# Altium schematic sheet myirBoard.SchDoc
size A4
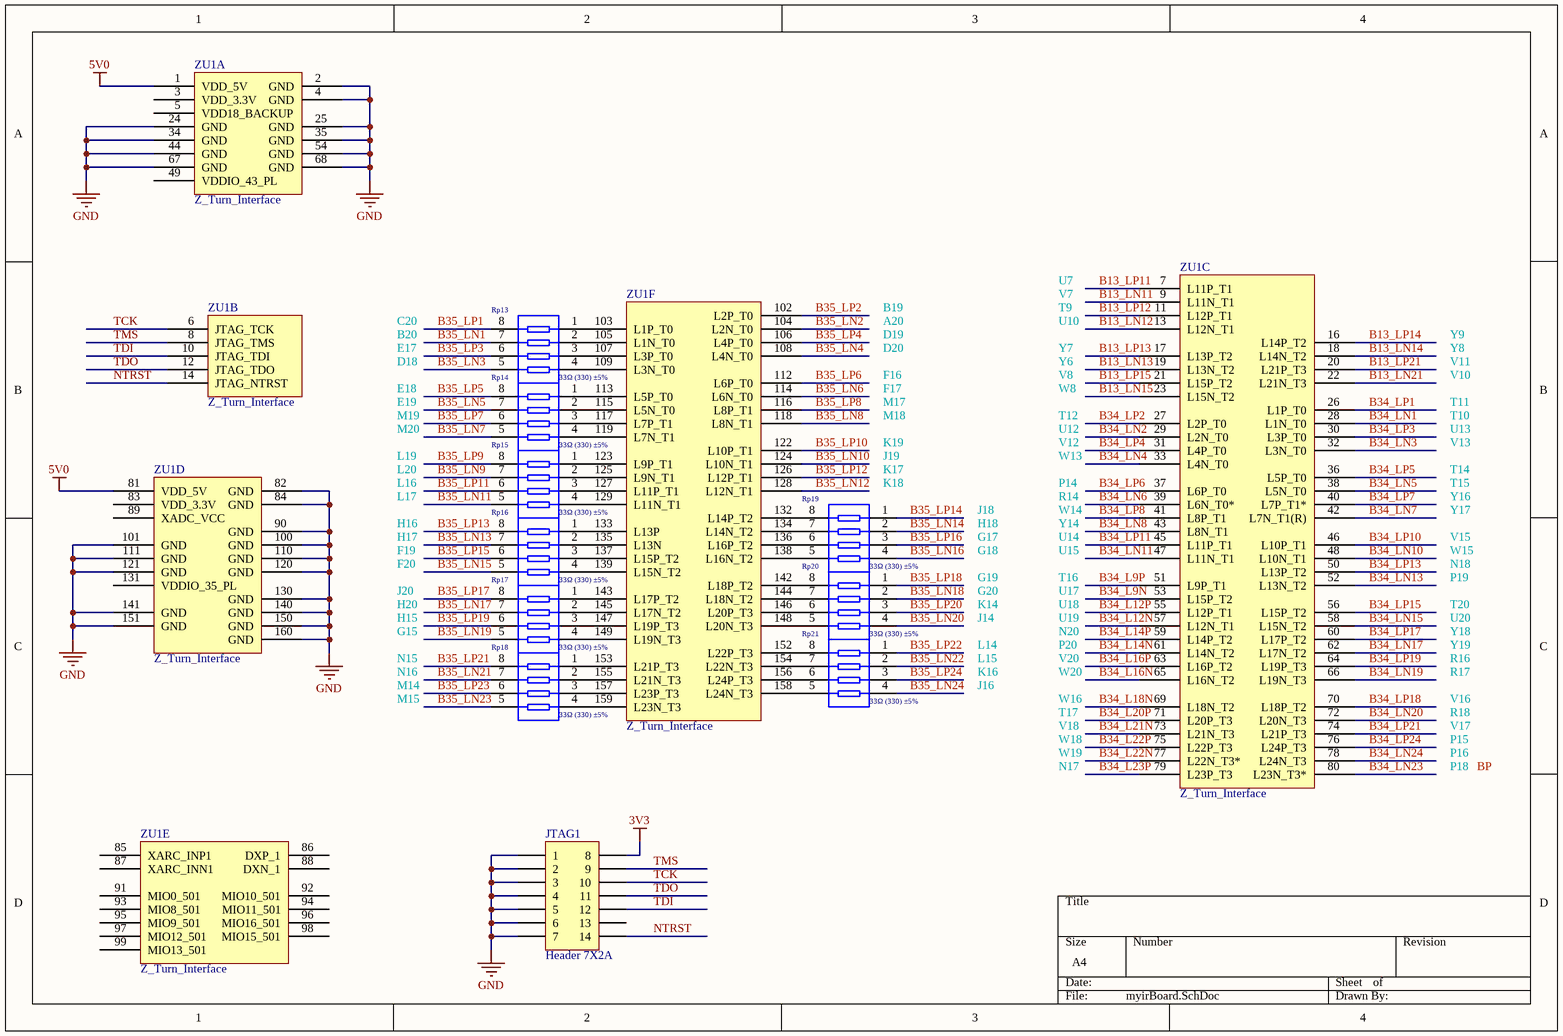
[diagram p0: myirBoard.SchDoc]

## Parts
JTAG1  Header 7X2A  [HDR2X7_CEN]
Rp13  33Ω (330) ±5%  [0402_Rx4]
Rp14  33Ω (330) ±5%  [0402_Rx4]
Rp15  33Ω (330) ±5%  [0402_Rx4]
Rp16  33Ω (330) ±5%  [0402_Rx4]
Rp17  33Ω (330) ±5%  [0402_Rx4]
Rp18  33Ω (330) ±5%  [0402_Rx4]
Rp19  33Ω (330) ±5%  [0402_Rx4]
Rp20  33Ω (330) ±5%  [0402_Rx4]
Rp21  33Ω (330) ±5%  [0402_Rx4]
ZU1  Z_Turn_Interface  [ZTURN]  (parts A,B,C,D,E,F of 6)

## Nets
3V3: JTAG1.8
5V0: ZU1.1(VDD_5V) ZU1.81(VDD_5V)
GND: JTAG1.1 JTAG1.2 JTAG1.3 JTAG1.4 JTAG1.5 JTAG1.6 JTAG1.7 ZU1.2(GND) ZU1.4(GND) ZU1.24(GND) ZU1.25(GND) ZU1.34(GND) ZU1.35(GND) ZU1.44(GND) ZU1.54(GND) ZU1.67(GND) ZU1.68(GND) ZU1.82(GND) ZU1.84(GND) ZU1.90(GND) ZU1.100(GND) ZU1.101(GND) ZU1.110(GND) ZU1.111(GND) ZU1.120(GND) ZU1.121(GND) ZU1.130(GND) ZU1.140(GND) ZU1.141(GND) ZU1.150(GND) ZU1.151(GND) ZU1.160(GND)
B13_LN11: ZU1.9(L11N_T1)
B13_LN12: ZU1.13(L12N_T1)
B13_LN13: ZU1.19(L13N_T2)
B13_LN14: ZU1.18(L14N_T2)
B13_LN15: ZU1.23(L15N_T2)
B13_LN21: ZU1.22(L21N_T3)
B13_LP11: ZU1.7(L11P_T1)
B13_LP12: ZU1.11(L12P_T1)
B13_LP13: ZU1.17(L13P_T2)
B13_LP14: ZU1.16(L14P_T2)
B13_LP15: ZU1.21(L15P_T2)
B13_LP21: ZU1.20(L21P_T3)
B34_L9N: ZU1.53(L15P_T2)
B34_L9P: ZU1.51(L9P_T1)
B34_L12N: ZU1.57(L12N_T1)
B34_L12P: ZU1.55(L12P_T1)
B34_L14N: ZU1.61(L14N_T2)
B34_L14P: ZU1.59(L14P_T2)
B34_L16N: ZU1.65(L16N_T2)
B34_L16P: ZU1.63(L16P_T2)
B34_L18N: ZU1.69(L18N_T2)
B34_L20P: ZU1.71(L20P_T3)
B34_L21N: ZU1.73(L21N_T3)
B34_L22N: ZU1.77(L22N_T3*)
B34_L22P: ZU1.75(L22P_T3)
B34_L23P: ZU1.79(L23P_T3)
B34_LN1: ZU1.28(L1N_T0)
B34_LN2: ZU1.29(L2N_T0)
B34_LN3: ZU1.32(L3N_T0)
B34_LN4: ZU1.33(L4N_T0)
B34_LN5: ZU1.38(L5N_T0)
B34_LN6: ZU1.39(L6N_T0*)
B34_LN7: ZU1.42(L7N_T1(R))
B34_LN8: ZU1.43(L8N_T1)
B34_LN10: ZU1.48(L10N_T1)
B34_LN11: ZU1.47(L11N_T1)
B34_LN13: ZU1.52(L13N_T2)
B34_LN15: ZU1.58(L15N_T2)
B34_LN17: ZU1.62(L17N_T2)
B34_LN19: ZU1.66(L19N_T3)
B34_LN20: ZU1.72(L20N_T3)
B34_LN23: ZU1.80(L23N_T3*)
B34_LN24: ZU1.78(L24N_T3)
B34_LP1: ZU1.26(L1P_T0)
B34_LP2: ZU1.27(L2P_T0)
B34_LP3: ZU1.30(L3P_T0)
B34_LP4: ZU1.31(L4P_T0)
B34_LP5: ZU1.36(L5P_T0)
B34_LP6: ZU1.37(L6P_T0)
B34_LP7: ZU1.40(L7P_T1*)
B34_LP8: ZU1.41(L8P_T1)
B34_LP10: ZU1.46(L10P_T1)
B34_LP11: ZU1.45(L11P_T1)
B34_LP13: ZU1.50(L13P_T2)
B34_LP15: ZU1.56(L15P_T2)
B34_LP17: ZU1.60(L17P_T2)
B34_LP18: ZU1.70(L18P_T2)
B34_LP19: ZU1.64(L19P_T3)
B34_LP21: ZU1.74(L21P_T3)
B34_LP24: ZU1.76(L24P_T3)
B35_LN1: Rp13.7
B35_LN2: ZU1.104(L2N_T0)
B35_LN3: Rp13.5
B35_LN4: ZU1.108(L4N_T0)
B35_LN5: Rp14.7
B35_LN6: ZU1.114(L6N_T0)
B35_LN7: Rp14.5
B35_LN8: ZU1.118(L8N_T1)
B35_LN9: Rp15.7
B35_LN10: ZU1.124(L10N_T1)
B35_LN11: Rp15.5
B35_LN12: ZU1.128(L12N_T1)
B35_LN13: Rp16.7
B35_LN14: Rp19.2
B35_LN15: Rp16.5
B35_LN16: Rp19.4
B35_LN17: Rp17.7
B35_LN18: Rp20.2
B35_LN19: Rp17.5
B35_LN20: Rp20.4
B35_LN21: Rp18.7
B35_LN22: Rp21.2
B35_LN23: Rp18.5
B35_LN24: Rp21.4
B35_LP1: Rp13.8
B35_LP2: ZU1.102(L2P_T0)
B35_LP3: Rp13.6
B35_LP4: ZU1.106(L4P_T0)
B35_LP5: Rp14.8
B35_LP6: ZU1.112(L6P_T0)
B35_LP7: Rp14.6
B35_LP8: ZU1.116(L8P_T1)
B35_LP9: Rp15.8
B35_LP10: ZU1.122(L10P_T1)
B35_LP11: Rp15.6
B35_LP12: ZU1.126(L12P_T1)
B35_LP13: Rp16.8
B35_LP14: Rp19.1
B35_LP15: Rp16.6
B35_LP16: Rp19.3
B35_LP17: Rp17.8
B35_LP18: Rp20.1
B35_LP19: Rp17.6
B35_LP20: Rp20.3
B35_LP21: Rp18.8
B35_LP22: Rp21.1
B35_LP23: Rp18.6
B35_LP24: Rp21.3
NTRST: JTAG1.14 ZU1.14(JTAG_NTRST)
TCK: JTAG1.10 ZU1.6(JTAG_TCK)
TDI: JTAG1.12 ZU1.10(JTAG_TDI)
TDO: JTAG1.11 ZU1.12(JTAG_TDO)
TMS: JTAG1.9 ZU1.8(JTAG_TMS)
NetRp13_1: Rp13.1 ZU1.103(L1P_T0)
NetRp13_2: Rp13.2 ZU1.105(L1N_T0)
NetRp13_3: Rp13.3 ZU1.107(L3P_T0)
NetRp13_4: Rp13.4 ZU1.109(L3N_T0)
NetRp14_1: Rp14.1 ZU1.113(L5P_T0)
NetRp14_2: Rp14.2 ZU1.115(L5N_T0)
NetRp14_3: Rp14.3 ZU1.117(L7P_T1)
NetRp14_4: Rp14.4 ZU1.119(L7N_T1)
NetRp15_1: Rp15.1 ZU1.123(L9P_T1)
NetRp15_2: Rp15.2 ZU1.125(L9N_T1)
NetRp15_3: Rp15.3 ZU1.127(L11P_T1)
NetRp15_4: Rp15.4 ZU1.129(L11N_T1)
NetRp16_1: Rp16.1 ZU1.133(L13P)
NetRp16_2: Rp16.2 ZU1.135(L13N)
NetRp16_3: Rp16.3 ZU1.137(L15P_T2)
NetRp16_4: Rp16.4 ZU1.139(L15N_T2)
NetRp17_1: Rp17.1 ZU1.143(L17P_T2)
NetRp17_2: Rp17.2 ZU1.145(L17N_T2)
NetRp17_3: Rp17.3 ZU1.147(L19P_T3)
NetRp17_4: Rp17.4 ZU1.149(L19N_T3)
NetRp18_1: Rp18.1 ZU1.153(L21P_T3)
NetRp18_2: Rp18.2 ZU1.155(L21N_T3)
NetRp18_3: Rp18.3 ZU1.157(L23P_T3)
NetRp18_4: Rp18.4 ZU1.159(L23N_T3)
NetRp19_5: Rp19.5 ZU1.138(L16N_T2)
NetRp19_6: Rp19.6 ZU1.136(L16P_T2)
NetRp19_7: Rp19.7 ZU1.134(L14N_T2)
NetRp19_8: Rp19.8 ZU1.132(L14P_T2)
NetRp20_5: Rp20.5 ZU1.148(L20N_T3)
NetRp20_6: Rp20.6 ZU1.146(L20P_T3)
NetRp20_7: Rp20.7 ZU1.144(L18N_T2)
NetRp20_8: Rp20.8 ZU1.142(L18P_T2)
NetRp21_5: Rp21.5 ZU1.158(L24N_T3)
NetRp21_6: Rp21.6 ZU1.156(L24P_T3)
NetRp21_7: Rp21.7 ZU1.154(L22N_T3)
NetRp21_8: Rp21.8 ZU1.152(L22P_T3)

Not connected (* = marked no-connect by the designer): JTAG1 13; ZU1 3(VDD_3.3V) 5(VDD18_BACKUP) 49(VDDIO_43_PL) 83(VDD_3.3V) 85(XARC_INP1) 86(DXP_1) 87(XARC_INN1) 88(DXN_1) 89(XADC_VCC) 91(MIO0_501) 92(MIO10_501) 93(MIO8_501) 94(MIO11_501) 95(MIO9_501) 96(MIO16_501) 97(MIO12_501) 98(MIO15_501) 99(MIO13_501) 131(VDDIO_35_PL)

## Notes on the sheet
- Labels drawn without touching a wire or pin: A20, B19, B20, BP, C20, D18, D19, D20, E17, E18, E19, F16, F17, F19, F20, G15, G17, G18, G19, G20, H15, H16, H17, H18, H20, J14, J16, J18, J19, J20, K14, K16, K17, K18, K19, L14, L15, L16, L17, L19, L20, M14, M15, M17, M18, M19, M20, N15, N16, N17, N18, N20, P14, P15, P16, P18, P19, P20, R14, R16, R17, R18, T9, T10, T11, T12, T14, T15, T16, T17, T20, U7, U10, U12, U13, U14, U15, U17, U18, U19, U20, V7, V8, V10, V11, V12, V13, V15, V16, V17, V18, V20, W8, W13, W14, W15, W16, W18, W19, W20, Y6, Y7, Y8, Y9, Y14, Y16, Y17, Y18, Y19

## Library data of the parts
JTAG1 = Header 7X2A: Header, 7-Pin, Dual row; LatestRevisionDate: 17-Jul-2002; LatestRevisionNote: Re-released for DXP Platform.; Publisher: Altium Limited
Rp13-Rp21 = 0402*4 33Ω (330) 5%: 贴片排阻; ComponentLink1Description: 供应商链接; ComponentLink1URL: http://www.szlcsc.com/product/details_26244.html; Package: 0402*4; Supplier: LC; SuppliersPartNumber: C25501